# Altium schematic sheet DeltaSigma8.SchDoc: LiveDesign Evaluation - EvalBoard Tester
size A4; Organization: Altium Limited; Address1: L3, 12a Rodborough Rd; Address2: Frenchs Forest; Address3: NSW; Address4: Australia 2086; DocumentNumber: 10; SheetNumber: 10; SheetTotal: 16
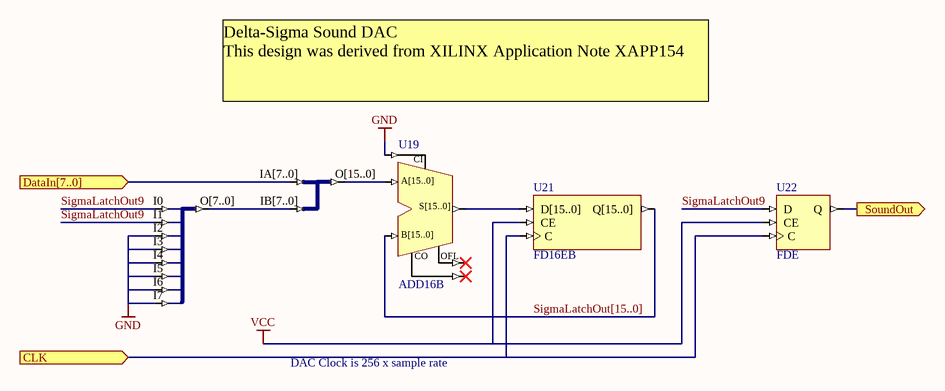
[diagram p0: DeltaSigma8.SchDoc]

## Parts
U19  ADD16B
U20  J8B2_16B  (value not drawn)
U21  FD16EB
U22  FDE
U23  J8S_8B  (value not drawn)

## Ports
CLK (in), DataIn[7..0] (in), SoundOut (out)

## Nets
GND: U19.CI U23.I2 U23.I3 U23.I4 U23.I5 U23.I6 U23.I7
VCC: U21.CE U22.CE
CLK: U21.C U22.C ; port CLK
DataIn[7..0]: U20.IA[7..0] ; port DataIn[7..0]
SigmaLatchOut9: U22.D U23.I0 U23.I1
SigmaLatchOut[15..0]: U19.B[15..0] U21.Q[15..0]
SoundOut: U22.Q ; port SoundOut
NetU19_A[15..0]: U19.A[15..0] U20.O[15..0]
NetU19_S[15..0]: U19.S[15..0] U21.D[15..0]
NetU20_IB[7..0]: U20.IB[7..0] U23.O[7..0]

Not connected (* = marked no-connect by the designer): U19 CO* OFL*

## Buses and harness runs
bus SigmaLatchOut[15..0]

## Notes on the sheet
- Delta-Sigma Sound DAC
  This design was derived from XILINX Application Note XAPP154
- DAC Clock is 256 x sample rate
- Title
- Size:
- Date:
- A4
- Number:
- Time:
- Revision:
- Sheet
- of
- File:

## Library data of the parts
U19 = ADD16B: 16-Bit Cascadable Full Adder with Signed and Unsigned Operations, Bus Version; Xilinx Equivalent: ADD16; ArchiveName: GENERIC; VHDLIB_SIM: GENERIC_LIB; Published: 29-Jan-2004; Publisher: Altium Limited; Core Revision: 1.00.00
U20 = J8B2_16B: 2 x 8-Bit input bus to 1 x 16-bit output bus; ArchiveName: GENERIC; VHDLIB_SIM: GENERIC_LIB; Published: 29-Jan-2004; Publisher: Altium Limited; Core Revision: 1.00.00
U21 = FD16EB: 16-Bit D Flip-Flop with Clock Enable, Bus Version; ArchiveName: GENERIC; VHDLIB_SIM: GENERIC_LIB; Published: 29-Jan-2004; Publisher: Altium Limited; Core Revision: 1.00.00
U22 = FDE: D Flip-Flop with Clock Enable; ArchiveName: GENERIC; VHDLIB_SIM: GENERIC_LIB; Published: 29-Jan-2004; Publisher: Altium Limited; Core Revision: 1.00.00
U23 = J8S_8B: 8 Single pin inputs to single 8-Bit output bus; ArchiveName: GENERIC; VHDLIB_SIM: GENERIC_LIB; Published: 29-Jan-2004; Publisher: Altium Limited; Core Revision: 1.00.00